# EAGLE schematic BodyTempUnit (EAGLE 8.4.1)
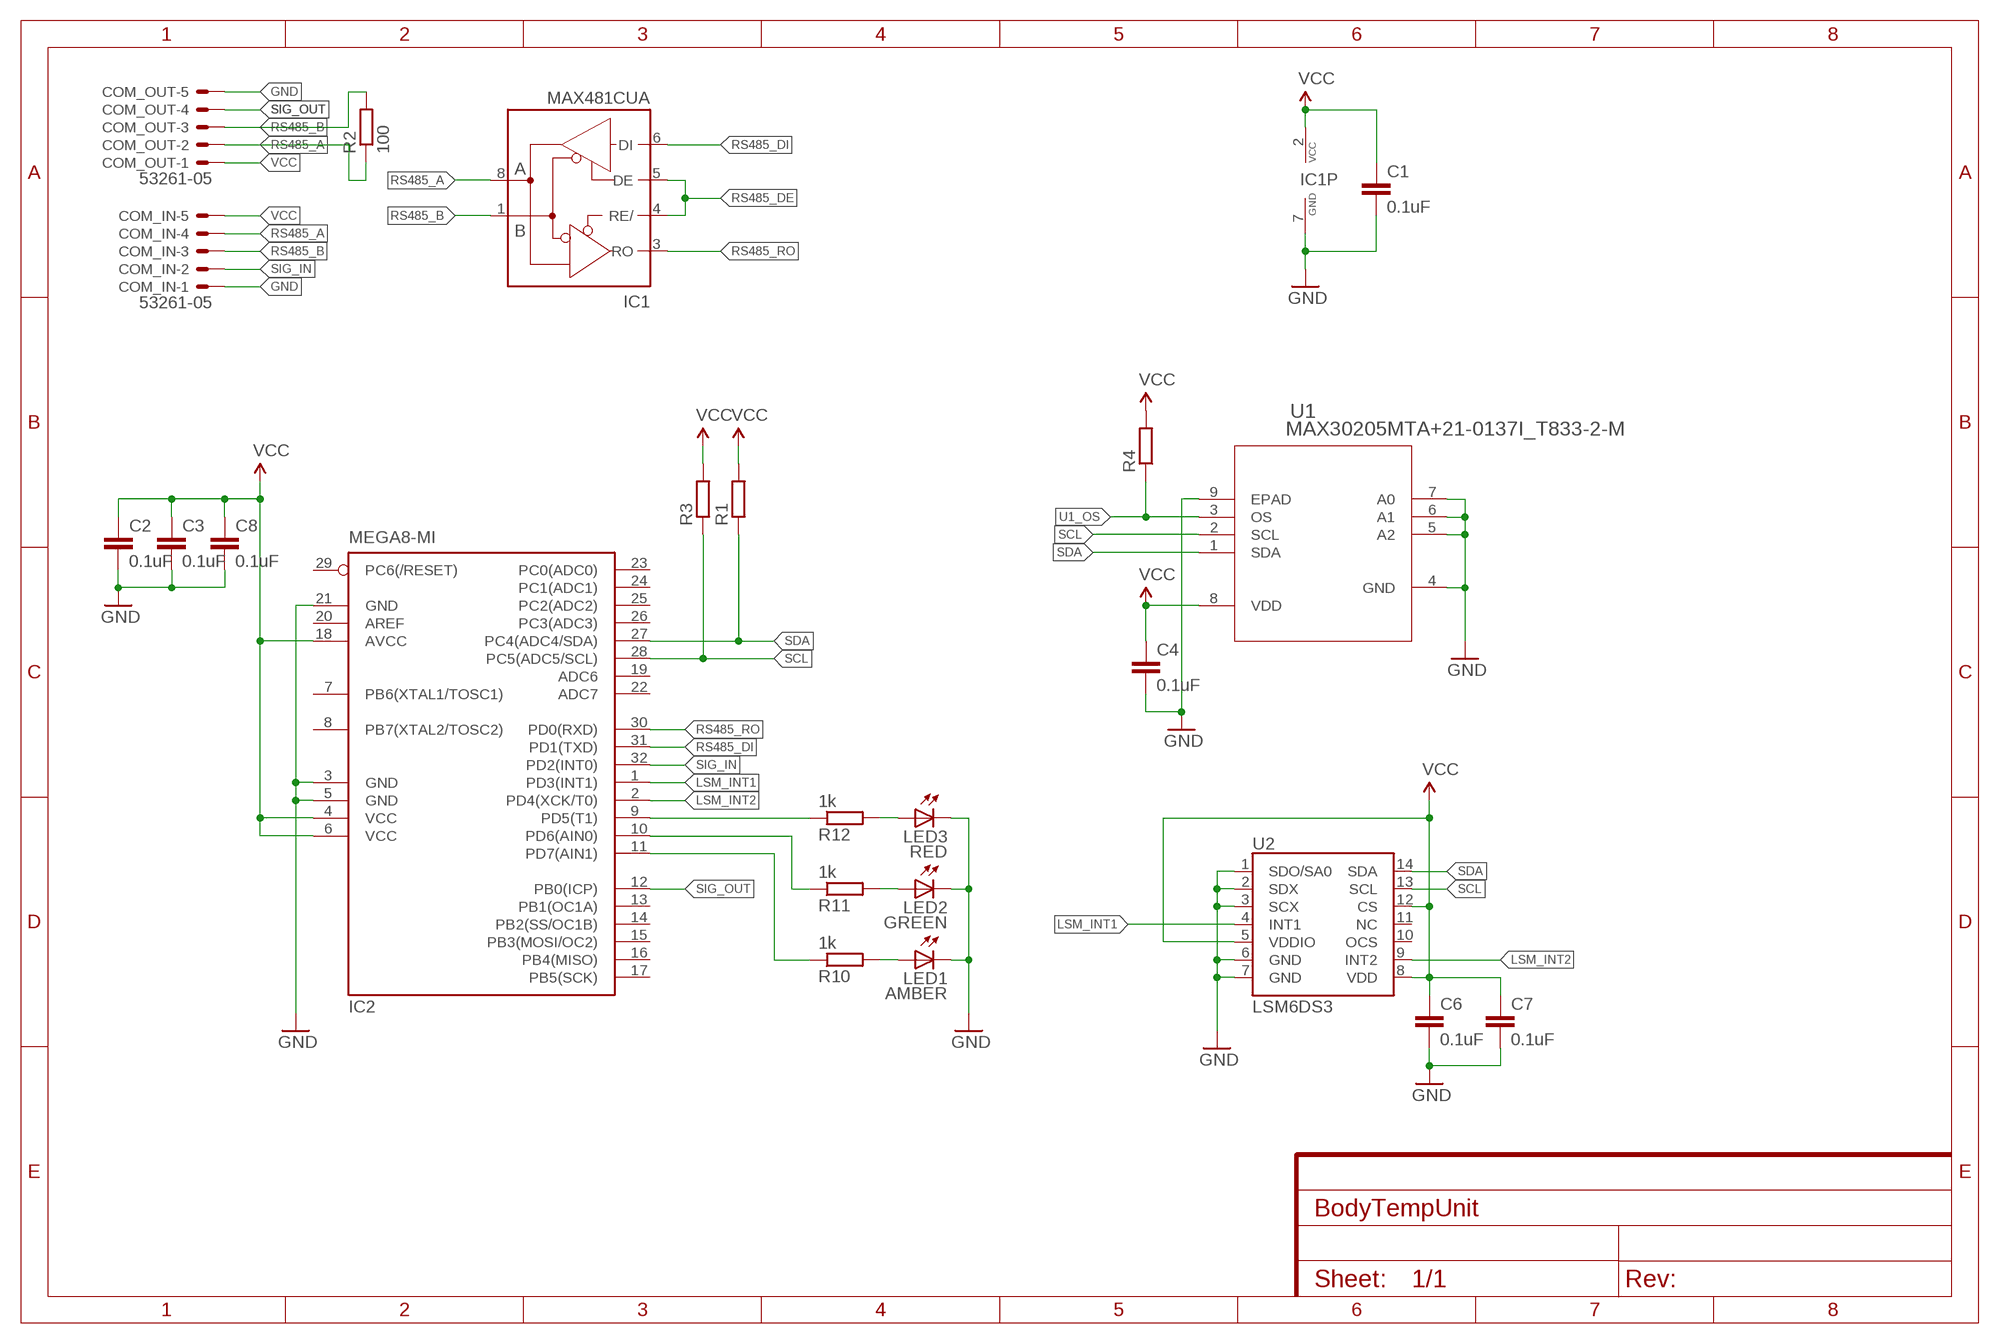
[diagram p0: schematic, sheet 1]

## Parts
C1  0.1uF  C-EUC0603K  [C0603K]
C2  0.1uF  C-EUC0603K  [C0603K]
C3  0.1uF  C-EUC0603K  [C0603K]
C4  0.1uF  C-EUC0603K  [C0603K]
C6  0.1uF  C-EUC0603K  [C0603K]
C7  0.1uF  C-EUC0603K  [C0603K]
C8  0.1uF  C-EUC0603K  [C0603K]
COM_IN  53261-05  [53261-05]
COM_OUT  53261-05  [53261-05]
IC1  MAX481CUA  [UMAX8]
IC2  MEGA8-MI  [MLF32]
LED1  AMBER  LEDCHIPLED_0603  [CHIPLED_0603]
LED2  GREEN  LEDCHIPLED_0603  [CHIPLED_0603]
LED3  RED  LEDCHIPLED_0603  [CHIPLED_0603]
R1  R-EU_R0603  [R0603]
R2  100  R-EU_R0603  [R0603]
R3  R-EU_R0603  [R0603]
R4  R-EU_R0603  [R0603]
R10  1k  R-EU_R0603  [R0603]
R11  1k  R-EU_R0603  [R0603]
R12  1k  R-EU_R0603  [R0603]
U1  MAX30205MTA+21-0137I_T833-2-M  [21-0137I_T833-2-M]
U2  LSM6DS3  [LGA14L]

## Nets
GND: C1.2 C2.2 C3.2 C4.2 C6.2 C7.2 C8.2 COM_IN.1 COM_OUT.5 IC1.7(GND) IC2.3(GND) IC2.5(GND) IC2.21(GND) LED1.C LED2.C LED3.C U1.4(GND) U1.5(A2) U1.6(A1) U1.7(A0) U1.9(EPAD) U2.1(SDO/SA0) U2.2(SDX) U2.3(SCX) U2.6(GND) U2.7(GND)
LSM_INT1: IC2.1(PD3(INT1)) U2.4(INT1)
LSM_INT2: IC2.2(PD4(XCK/T0)) U2.9(INT2)
N$5: IC2.10(PD6(AIN0)) R11.1
N$6: LED3.A R12.2
N$7: LED2.A R11.2
N$8: LED1.A R10.2
N$9: IC2.11(PD7(AIN1)) R10.1
N$10: IC2.9(PD5(T1)) R12.1
RS485_A: COM_IN.4 COM_OUT.2 IC1.8(A) R2.1
RS485_B: COM_IN.3 COM_OUT.3 IC1.1(B) R2.2
RS485_DE: IC1.4(RE/) IC1.5(DE)
RS485_DI: IC1.6(DI) IC2.31(PD1(TXD))
RS485_RO: IC1.3(RO) IC2.30(PD0(RXD))
SCL: IC2.28(PC5(ADC5/SCL)) R3.1 U1.2(SCL) U2.13(SCL)
SDA: IC2.27(PC4(ADC4/SDA)) R1.1 U1.1(SDA) U2.14(SDA)
SIG_IN: COM_IN.2 IC2.32(PD2(INT0))
SIG_OUT: COM_OUT.4 IC2.12(PB0(ICP))
U1_OS: R4.1 U1.3(OS)
VCC: C1.1 C2.1 C3.1 C4.1 C6.1 C7.1 C8.1 COM_IN.5 COM_OUT.1 IC1.2(VCC) IC2.4(VCC) IC2.6(VCC) IC2.18(AVCC) R1.2 R3.2 R4.2 U1.8(VDD) U2.5(VDDIO) U2.8(VDD) U2.12(CS)
Unconnected: IC2.7(PB6(XTAL1/TOSC1)) IC2.8(PB7(XTAL2/TOSC2)) IC2.13(PB1(OC1A)) IC2.14(PB2(SS/OC1B)) IC2.15(PB3(MOSI/OC2)) IC2.16(PB4(MISO)) IC2.17(PB5(SCK)) IC2.19(ADC6) IC2.20(AREF) IC2.22(ADC7) IC2.23(PC0(ADC0)) IC2.24(PC1(ADC1)) IC2.25(PC2(ADC2)) IC2.26(PC3(ADC3)) IC2.29(PC6(/RESET)) U2.10(OCS) U2.11(NC)

## Library data of the parts
C1-C4 C6-C8 = rcl:C-EU: CAPACITOR, European symbol; SPICEPREFIX: C
COM_IN COM_OUT = con-molex:53?-05: CONNECTOR wire to board 1.25 mm (.049 inch) pitch header; MF: MOLEX; OC_FARNELL: 1433644; OC_NEWARK: unknown
IC1 = maxim:MAX481CUA: RS485 TRANSEIVER; MPN: MAX481CUA+; OC_FARNELL: unknown; OC_NEWARK: 71P2381
IC2 = atmel:MEGA8: MICROCONTROLLER 8 Kbytes FLASH, 1 kbytes SRAM, 512 bytes EEPROM, USART, 6-channel 10 bit ADC, 2-channel 8 bit ADC Pin compatible with Atmega48, ATMega88, ATMega168 Source: avr.lbr; MPN: ATMEGA88PA-MU; OC_FARNELL: 1715491; OC_NEWARK: 15R0272
LED1-LED3 = adafruit:LED: LED OSRAM: - CHIPLED LG R971, LG N971, LY N971, LG Q971, LY Q971, LO R971, LY R971 LH N974, LH R974 LS Q976, LO Q976, LY Q976 LO Q996 - Hyper CHIPLED LW Q18S LB Q993, LB Q99A, LB R99A - SideLED LS A670, LO A670, LY A670, LG A670, LP A670 LB A673, LV A673, LT A673, LW A673 LH A674 LY A675 LS A676, LA A676, LO A676, LY A676, LW A676 LS A679, LY A679, LG A679 - Hyper Micro SIDELED® LS Y876, LA Y876, LO Y876, LY Y876 LT Y87S - SmartLED LW L88C, LW L88S LB L89C, LB L89S, LG L890 LS L89K, LO L89K, LY L89K LS L896, LA L896, LO L896, LY L896 - TOPLED LS T670, LO T670, LY T670, LG T670, LP T670 LSG T670, LSP T670, LSY T670, LOP T670, LYG T670 LG T671, LOG T671, LSG T671 LB T673, LV T673, LT T673, LW T673 LH T674 LS T676, LA T676, LO T676, LY T676, LB T676, LH T676, LSB T676, LW T676 LB T67C, LV T67C, LT T67C, LS T67K, LO T67K, LY T67K, LW E67C LS E67B, LA E67B, LO E67B, LY E67B, LB E67C, LV E67C, LT E67C LW T67C LS T679, LY T679, LG T679 LS T770, LO T770, LY T770, LG T770, LP T770 LB T773, LV T773, LT T773, LW T773 LH T774 LS E675, LA E675, LY E675, LS T675 LS T776, LA T776, LO T776, LY T776, LB T776 LHGB T686 LT T68C, LB T68C - Hyper Mini TOPLED® LB M676 - Mini TOPLED Santana® LG M470 LS M47K, LO M47K, LY M47K Source: http://www.osram.convergy.de/
R1-R4 = rcl:R-EU_: RESISTOR, European symbol; SPICEPREFIX: R
R10-R12 = rcl:R-EU_: RESISTOR, European symbol
U1 = simbits:MAX30205MTA+; MANUFACTURER_PART_NUMBER: MAX30205MTA+; VENDOR: Maxim Integrated Products
U2 = LSM6DS3:LSM6DS3